# Altium schematic sheet ANALOG_MUX.SchDoc
size A4; SheetNumber: 4; SheetTotal: 13
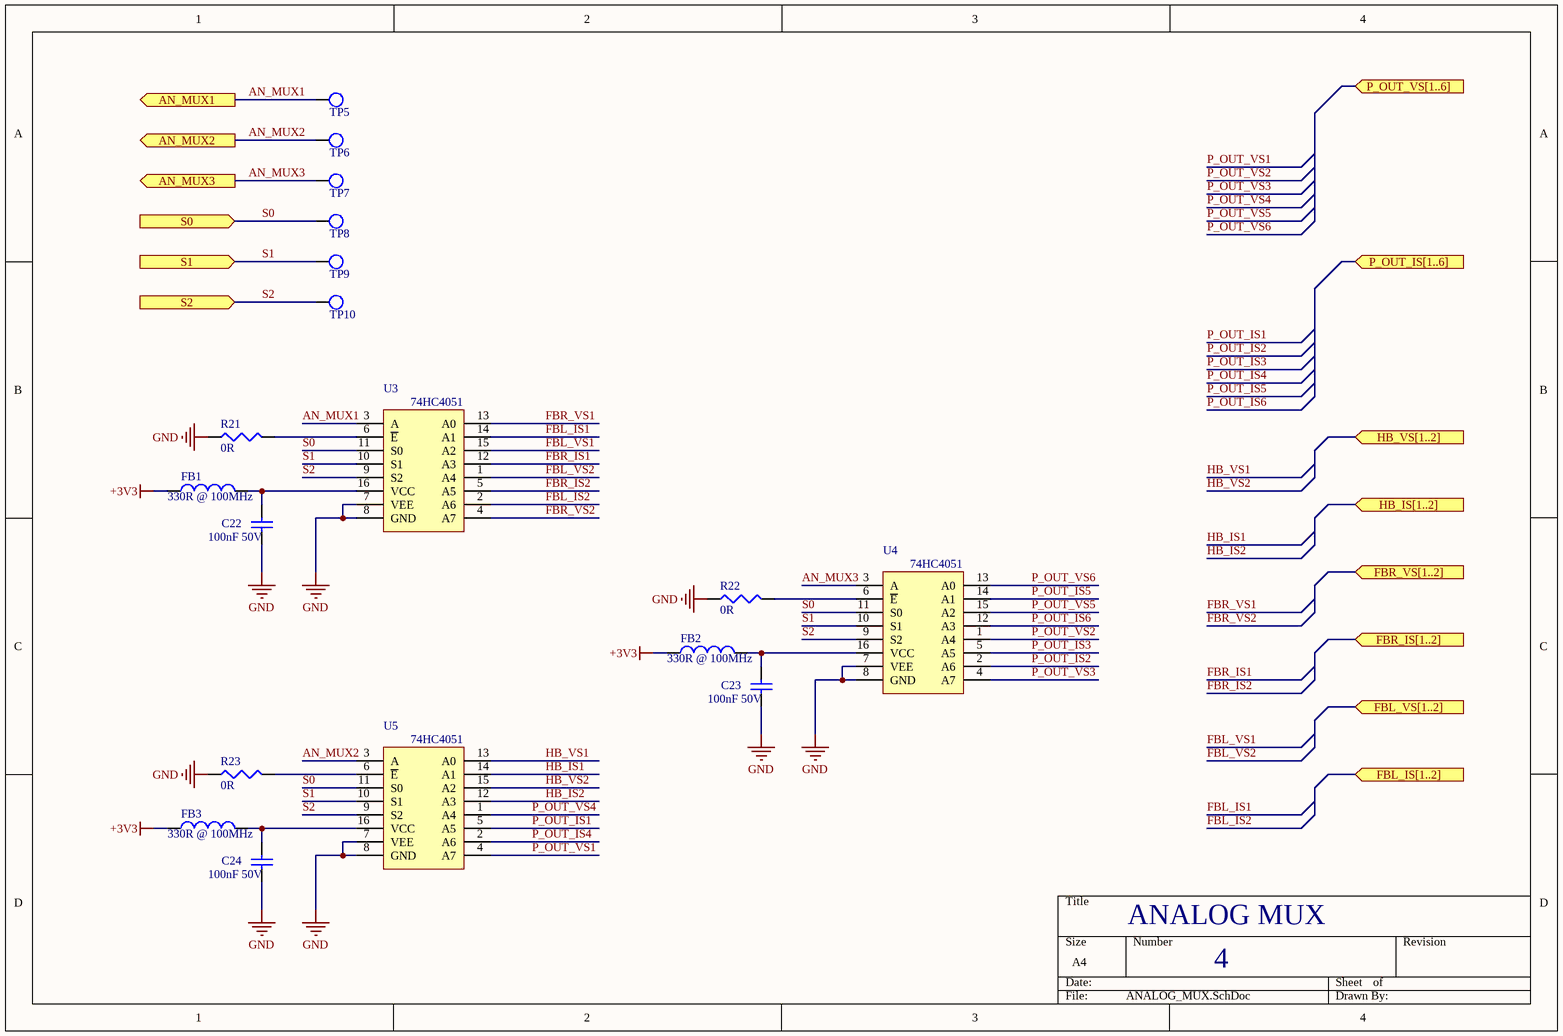
[diagram p0: ANALOG_MUX.SchDoc]

## Parts
C22  100nF 50V  [CAP0603]
C23  100nF 50V  [CAP0603]
C24  100nF 50V  [CAP0603]
FB1  330R @ 100MHz  [FB0603]
FB2  330R @ 100MHz  [FB0603]
FB3  330R @ 100MHz  [FB0603]
R21  0R  [RES0603]
R22  0R  [RES0603]
R23  0R  [RES0603]
TP5  TEST_POINT  [TEST_POINT_TH]  (value not drawn)  (no BOM)
TP6  TEST_POINT  [TEST_POINT_TH]  (value not drawn)  (no BOM)
TP7  TEST_POINT  [TEST_POINT_TH]  (value not drawn)  (no BOM)
TP8  TEST_POINT  [TEST_POINT_TH]  (value not drawn)  (no BOM)
TP9  TEST_POINT  [TEST_POINT_TH]  (value not drawn)  (no BOM)
TP10  TEST_POINT  [TEST_POINT_TH]  (value not drawn)  (no BOM)
U3  74HC4051  [TSSOP16]
U4  74HC4051  [TSSOP16]
U5  74HC4051  [TSSOP16]

## Ports
AN_MUX1 (out), AN_MUX2 (out), AN_MUX3 (out), FBL_IS[1..2] (in), FBL_VS[1..2] (in), FBR_IS[1..2] (in), FBR_VS[1..2] (in), HB_IS[1..2] (in), HB_VS[1..2] (in), P_OUT_IS[1..6] (in), P_OUT_VS[1..6] (in), S0 (in), S1 (in), S2 (in)

## Nets
+3V3: FB1.1 FB2.1 FB3.1
GND: C22.1 C23.1 C24.1 R21.1 R22.1 R23.1 U3.7(VEE) U3.8(GND) U4.7(VEE) U4.8(GND) U5.7(VEE) U5.8(GND)
AN_MUX1: TP5.1 U3.3(A) ; port AN_MUX1
AN_MUX2: TP6.1 U5.3(A) ; port AN_MUX2
AN_MUX3: TP7.1 U4.3(A) ; port AN_MUX3
FBL_IS1: U3.14(A1)
FBL_IS2: U3.2(A6)
FBL_VS1: U3.15(A2)
FBL_VS2: U3.1(A4)
FBR_IS1: U3.12(A3)
FBR_IS2: U3.5(A5)
FBR_VS1: U3.13(A0)
FBR_VS2: U3.4(A7)
HB_IS1: U5.14(A1)
HB_IS2: U5.12(A3)
HB_VS1: U5.13(A0)
HB_VS2: U5.15(A2)
P_OUT_IS1: U5.5(A5)
P_OUT_IS2: U4.2(A6)
P_OUT_IS3: U4.5(A5)
P_OUT_IS4: U5.2(A6)
P_OUT_IS5: U4.14(A1)
P_OUT_IS6: U4.12(A3)
P_OUT_VS1: U5.4(A7)
P_OUT_VS2: U4.1(A4)
P_OUT_VS3: U4.4(A7)
P_OUT_VS4: U5.1(A4)
P_OUT_VS5: U4.15(A2)
P_OUT_VS6: U4.13(A0)
S0: TP8.1 U3.11(S0) U4.11(S0) U5.11(S0) ; port S0
S1: TP9.1 U3.10(S1) U4.10(S1) U5.10(S1) ; port S1
S2: TP10.1 U3.9(S2) U4.9(S2) U5.9(S2) ; port S2
NetC22_2: C22.2 FB1.2 U3.16(VCC)
NetC23_2: C23.2 FB2.2 U4.16(VCC)
NetC24_2: C24.2 FB3.2 U5.16(VCC)
NetR21_2: R21.2 U3.6(~{E})
NetR22_2: R22.2 U4.6(~{E})
NetR23_2: R23.2 U5.6(~{E})

## Notes on the sheet
- ANALOG MUX

## Library data of the parts
C22-C24 = CAP0603_100nF: CAP CER 0.1UF 50V X7R 0603; P/N: C0603C104K5RACTU; Order Code: DIGI : 399-5089-1-ND; Value: 100nF 50V
FB1-FB3 = FB0603_330R@100MHz: FERRITE BEAD 330 OHM 0603 1LN; P/N: BLM18SG331TN1D; Order Code: DIGI : 490-3997-1-ND; Value: 330R @ 100MHz
R21-R23 = RES0603_0R: RES SMD 0 OHM JUMPER 1/10W 0603; Order Code: DIGI : P0.0GCT-ND; P/N: ERJ-3GEY0R00V; ART Code: ART0016157; Value: 0R
U3-U5 = AN_MUX_CD74HC4051: IC MUX/DEMUX 8X1 16TSSOP; P/N: CD74HC4051QPWRQ1; Order Code: DIGI : 296-31590-1-ND; Value: 8:1